# Altium project STM32_HM10_DC.PrjPcb
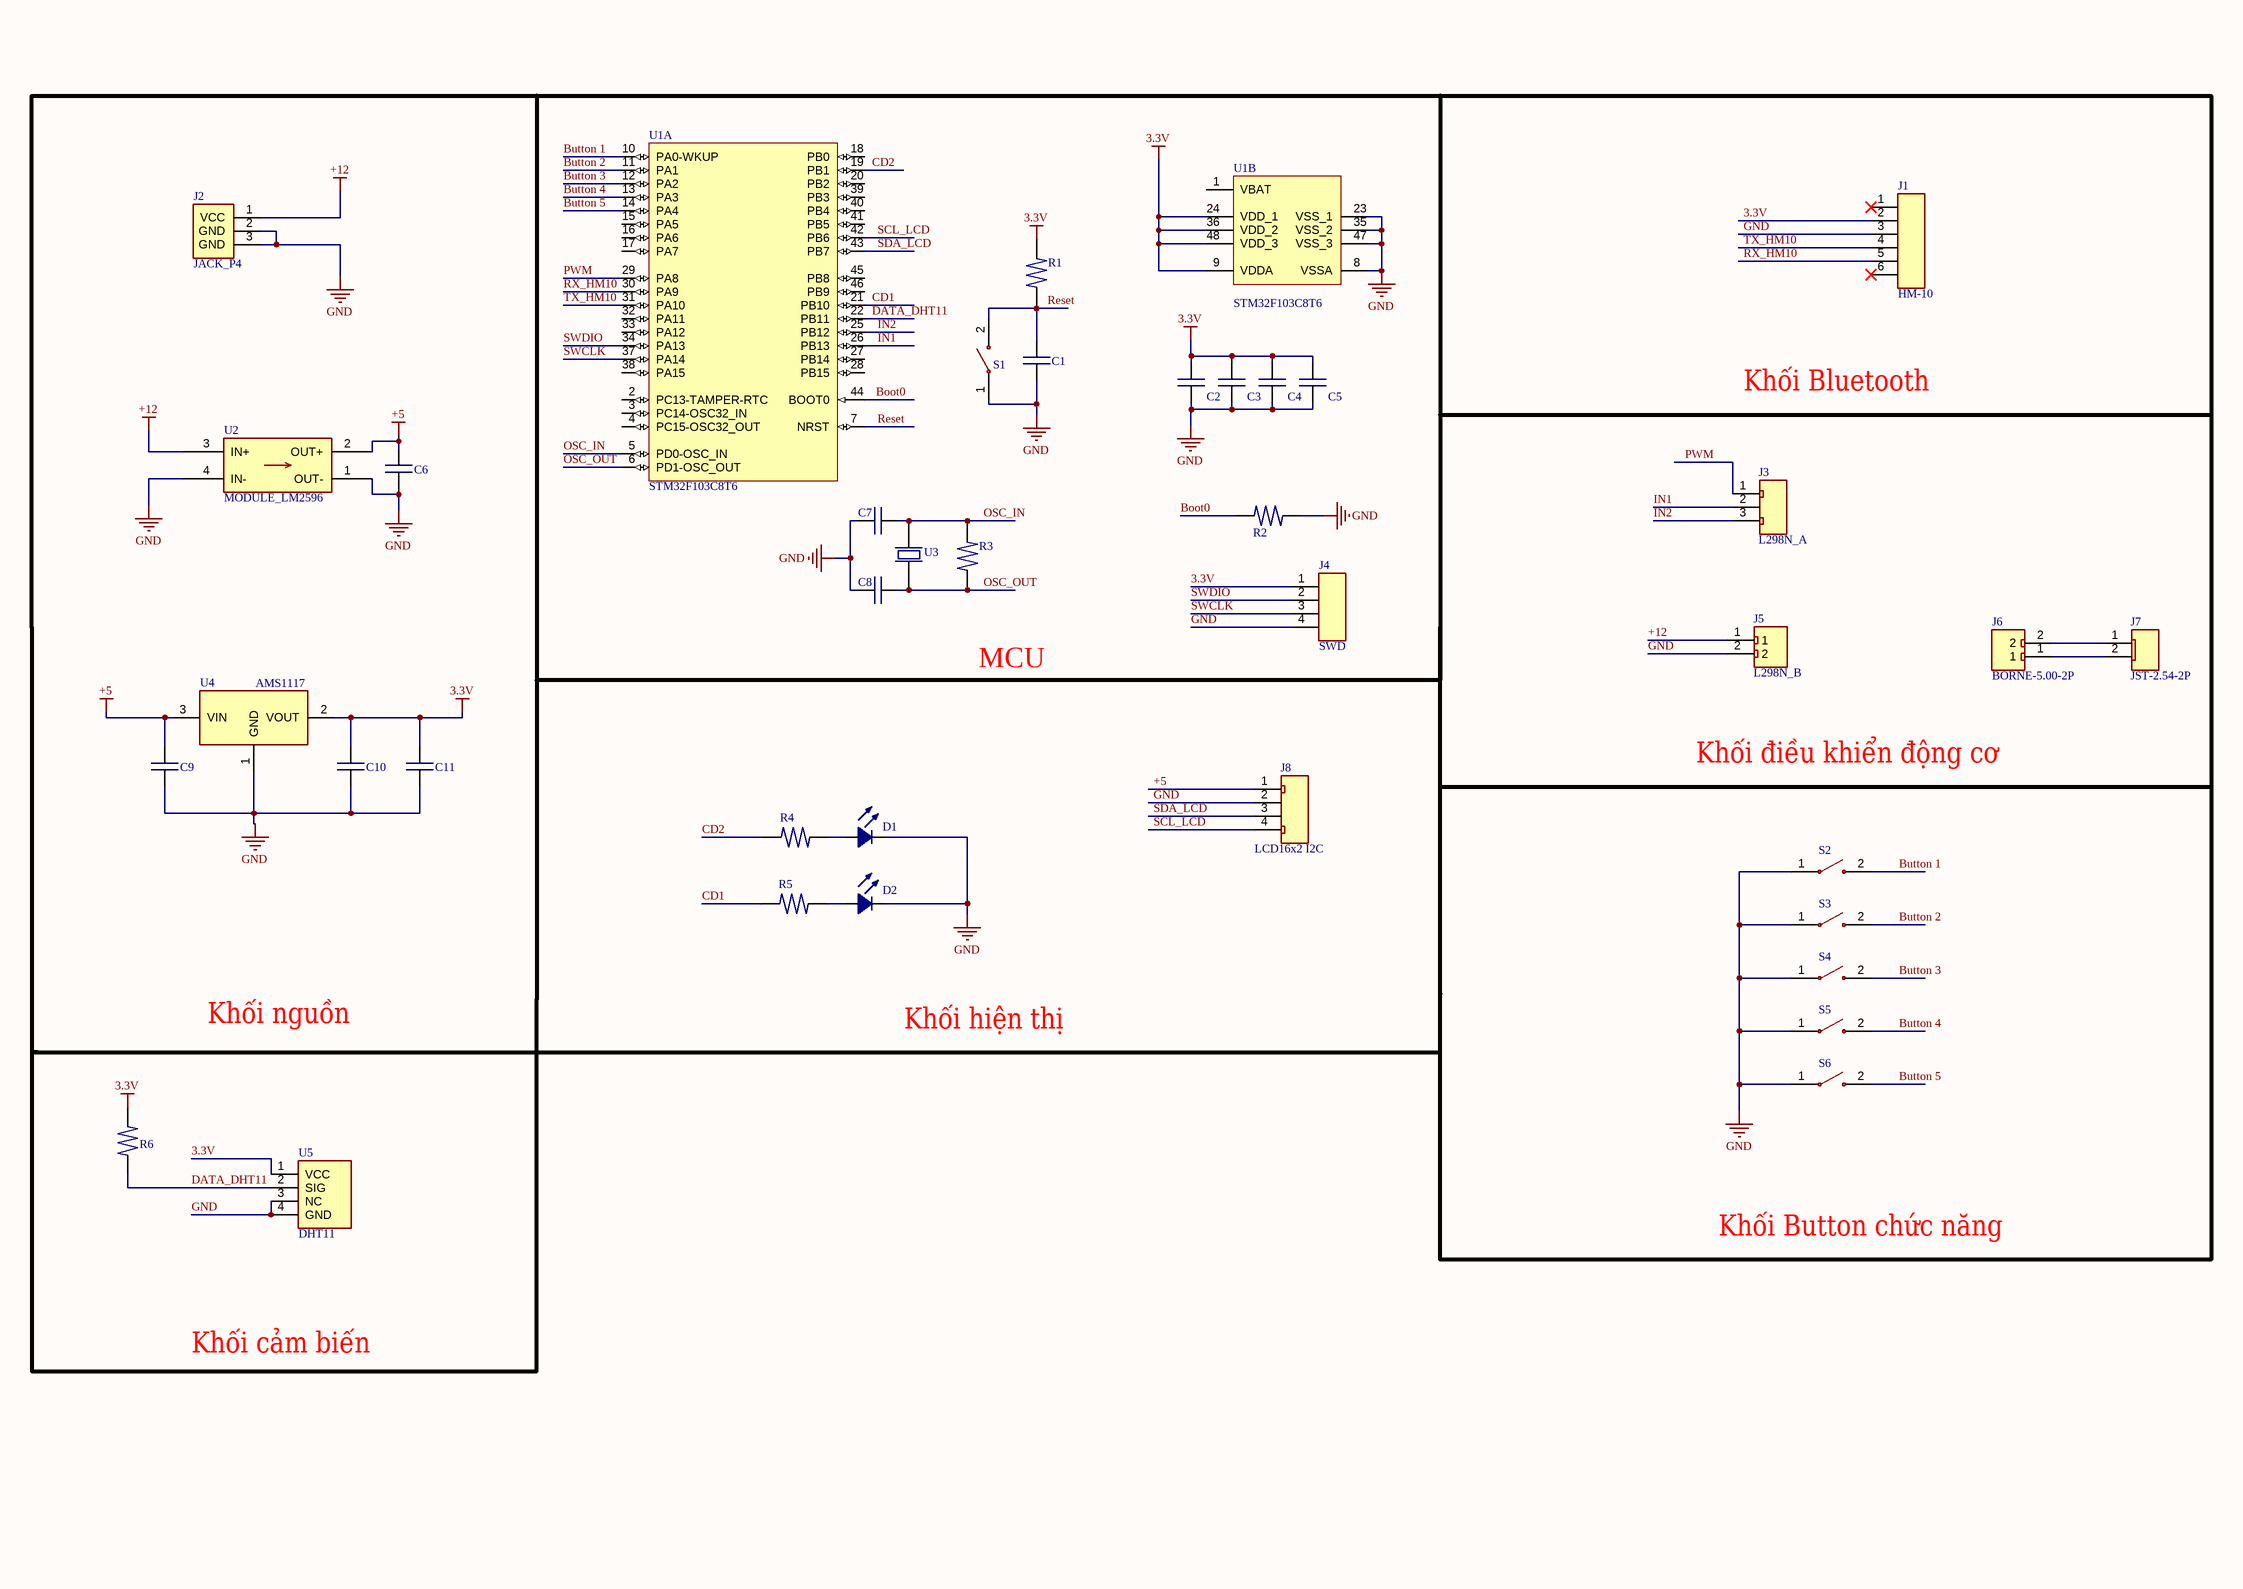
[diagram p0: Nguyen_Ly.SchDoc]
1 sheet, 38 parts. Net scope: global (net labels, ports and power ports of the same name join across sheets).
Board file: Mach_in.PcbDoc

## Sheet Nguyen_Ly.SchDoc
size 420 x 297 mm; SheetNumber: 1; SheetTotal: 1

### Parts
C1  CAPCITOR 104  [CAPACITOR 104]  (value not drawn)
C2  CAPACITOR 0603  [CAPACITOR 0603]  (value not drawn)
C3  CAPACITOR 0603  [CAPACITOR 0603]  (value not drawn)
C4  CAPACITOR 0603  [CAPACITOR 0603]  (value not drawn)
C5  CAPACITOR 0603  [CAPACITOR 0603]  (value not drawn)
C6  CAPCITOR 104  [CAPACITOR 104]  (value not drawn)
C7  CAPACITOR 0603  [CAPACITOR 0603]  (value not drawn)
C8  CAPACITOR 0603  [CAPACITOR 0603]  (value not drawn)
C9  CAPACITOR 0603  [CAPACITOR 0603]  (value not drawn)
C10  CAPACITOR 0603  [CAPACITOR 0603]  (value not drawn)
C11  CAPACITOR 0603  [CAPACITOR 0603]  (value not drawn)
D1  LED_5mm_YELLOW  [LED_5mm_YELLOW]  (value not drawn)
D2  LED_5mm_RED  [LED_5mm_RED]  (value not drawn)
J1  HM-10  [FEMALE-2.54-6P]
J2  JACK_P4  [JACK_P4]
J3  L298N_A  [JST-2.54-3P]
J4  SWD  [MALE-2.54-4P]
J5  L298N_B  [BORNE-5.00-2P]
J6  BORNE-5.00-2P  [BORNE-5.00-2P]
J7  JST-2.54-2P  [JST-2.54-2P]
J8  LCD16x2 I2C  [JST-2.54-4P]
R1  RESISTOR_9.5mm  [RESISTOR_PTH_9.5mm]  (value not drawn)
R2  RESISTOR_0603  [RESISTOR_0603]  (value not drawn)
R3  RESISTOR_0603  [RESISTOR_0603]  (value not drawn)
R4  RESISTOR_9.5mm  [RESISTOR_PTH_9.5mm]  (value not drawn)
R5  RESISTOR_9.5mm  [RESISTOR_PTH_9.5mm]  (value not drawn)
R6  RESISTOR_9.5mm  [RESISTOR_PTH_9.5mm]  (value not drawn)
S1  PUSH_BUTTON_6X6  [PUSH_BUTTON_6X6]  (value not drawn)
S2  PUSH_BUTTON_6X6  [PUSH_BUTTON_6X6]  (value not drawn)
S3  PUSH_BUTTON_6X6  [PUSH_BUTTON_6X6]  (value not drawn)
S4  PUSH_BUTTON_6X6  [PUSH_BUTTON_6X6]  (value not drawn)
S5  PUSH_BUTTON_6X6  [PUSH_BUTTON_6X6]  (value not drawn)
S6  PUSH_BUTTON_6X6  [PUSH_BUTTON_6X6]  (value not drawn)
U1  STM32F103C8T6  [STM-LQFP48_N]  (parts A,B of 2)
U2  MODULE_LM2596  [MODULE_LM2596]
U3  CRISTAL_16Mhz  [CRISTAL_16Mhz_SMD]  (value not drawn)
U4  AMS1117  [AMS1117]
U5  DHT11  [DHT11]

### Nets
3.3V: C2.2 C3.2 C4.2 C5.2 C10.2 C11.2 J1.2 J4.1 R1.2 R6.2 U1.9(VDDA) U1.24(VDD_1) U1.36(VDD_2) U1.48(VDD_3) U4.2(VOUT) U5.1(VCC)
+5: C6.2 C9.2 J8.1 U2.2(OUT+) U4.3(VIN)
+12: J2.1(VCC) J5.1 U2.3(IN+)
GND: C1.1 C2.1 C3.1 C4.1 C5.1 C6.1 C7.1 C8.1 C9.1 C10.1 C11.1 D1.2 D2.2 J1.3 J2.2(GND) J2.3(GND) J4.4 J5.2 J8.2 R2.1 S1.1 S2.1 S3.1 S4.1 S5.1 S6.1 U1.8(VSSA) U1.23(VSS_1) U1.35(VSS_2) U1.47(VSS_3) U2.1(OUT-) U2.4(IN-) U4.1(GND) U5.3(NC) U5.4(GND)
Boot0: R2.2 U1.44(BOOT0)
Button 1: S2.2 U1.10(PA0-WKUP)
Button 2: S3.2 U1.11(PA1)
Button 3: S4.2 U1.12(PA2)
Button 4: S5.2 U1.13(PA3)
Button 5: S6.2 U1.14(PA4)
CD1: R5.1 U1.21(PB10)
CD2: R4.1 U1.19(PB1)
DATA_DHT11: R6.1 U1.22(PB11) U5.2(SIG)
IN1: J3.2 U1.26(PB13)
IN2: J3.3 U1.25(PB12)
OSC_IN: C7.2 R3.2 U1.5(PD0-OSC_IN) U3.2
OSC_OUT: C8.2 R3.1 U1.6(PD1-OSC_OUT) U3.1
PWM: J3.1 U1.29(PA8)
Reset: C1.2 R1.1 S1.2 U1.7(NRST)
RX_HM10: J1.5 U1.30(PA9)
SCL_LCD: J8.4 U1.42(PB6)
SDA_LCD: J8.3 U1.43(PB7)
SWCLK: J4.3 U1.37(PA14)
SWDIO: J4.2 U1.34(PA13)
TX_HM10: J1.4 U1.31(PA10)
NetD1_1: D1.1 R4.2
NetD2_1: D2.1 R5.2
NetJ6_1: J6.1 J7.2
NetJ6_2: J6.2 J7.1

Not connected (* = marked no-connect by the designer): J1 1* 6*; U1 1(VBAT) 2(PC13-TAMPER-RTC) 3(PC14-OSC32_IN) 4(PC15-OSC32_OUT) 15(PA5) 16(PA6) 17(PA7) 18(PB0) 20(PB2) 27(PB14) 28(PB15) 32(PA11) 33(PA12) 38(PA15) 39(PB3) 40(PB4) 41(PB5) 45(PB8) 46(PB9)

### Notes on the sheet
- Khối Bluetooth
- MCU
- Khối điều khiển động cơ
- Khối nguồn
- Khối hiện thị
- Khối Button chức năng
- Khối cảm biến
- THIS DOCUMENT AND THE DATA DISCLOSED HEREIN OR
- HEREWITH IS THE PROPERTY OF ALTIUM LIMITED AND MAY
- DWG NO:
- REVISION
- REV:
- DESCRIPTION
- DATE
- APPROVED
- BE FREELY DISTRIBUTED IN WHOLE. NO RIGHTS ARE
- RESERVED OR EXPRESS OR IMPLIED WARANTEE GIVEN.
- ENG:
- APPROVALS
- PROJECT
- DSN:
- CHK:
- REFERENCE DOCUMENTS
- PROJECT REVISION:
- TITLE
- DOCUMENT REVISION:
- DESIGN ITEM:
- BOM:
- FAB DWG:
- PCB DWG:
- ASSY DWG:
- SCALE:
- A3
- SIZE
- CAGE CODE
- FILE NAME
- DWG NO.
- SHEET
- OF
- REV

### Library data of the parts
C1 C6 = CAPACITOR 104: Ceramic Capacitor 104, 3mm.
C2-C5 C7-C11 = CAPACITOR 0603: Generic Capacitor 0603, 1.6x0.8x0.9mm.
D1 = LED_5mm_YELLOW: LED PTH 5mm Yellow.
D2 = LED_5mm_RED: LED PTH 5mm Red.
J1 = FEMALE-2.54-6P: Female Header Connector 2.54mm 6 Pins.; JLCPCB PN: C5224026
J2 = JACK_P4: 9V Battery Connector Jack P4.
J3 = JST-2.54-3P: Female Connector JST 3 Vias, 2.54mm.
J4 = MALE-2.54-4P: Male Header Connector 2.54mm 4 Pins.; JLCPCB PN: C492403
J5 J6 = BORNE-5.00-2P: Borne 2 Vias, Pitch 5mm.; JLCPCB PN: C91153
J7 = JST-2.54-2P: Female Connector JST 2 Vias, 2.54mm.
J8 = JST-2.54-4P: Female Connector JST 4 Vias, 2.54mm.
R1 R4-R6 = RESISTOR_9.5mm: Generic Resistor 9.5mm.
R2 R3 = RESISTOR_0603: Generic Resistor 0603.
S1-S6 = PUSH_BUTTON_6X6: Push Button Tactile Switch PTH 4 Pins 6x6mm.; JLCPCB PN: C255811
U1 = STM32F103C8T6: ARM Cortex-M3 32-bit MCU, 64 KB Flash, 20 KB Internal RAM, 37 I/Os, 48-pin LQFP, -40 to 85 degC, Tray; A/D Converter: 2x12-bit (10 Channel); FLASH Size (Prog) (kB): 64; I/Os (High Current): 37; Internal RAM Size (kB): 20; Operating Frequency(F) (Processor speed) (MHz): 72; Supply Voltage(Vcc) min (V): 2; DatasheetVersion: Rev. 16; PackageVersion: Rev. 6, 06/2013; PackageReference: LQFP48; PackageDescription: 48-Pin Low Profile Quad Flat Package, 7 x 7 mm Body, 0.5 mm Pitch; Supplier 1: Digi-Key; Supplier Part Number 1: 497-6063-ND; Supplier 2: Farnell; Supplier Part Number 2: 1447637; Supplier 3: Newark; Supplier Part Number 3: 59M2182; Supplier 4: Newark; Supplier Part Number 4: 57P1222; Supplier 5: Mouser; Supplier Part Number 5: 511-STM32F103C8T6; Core: ARM Cortex-M3; Packing: Tray; Mounting Technology: Surface Mount; PartNumber: STM32F103C8T6; ComponentLink1Description: Manufacturer URL; ComponentLink1URL: http://www.st.com/web/en/home.html; ComponentLink2Description: Datasheet; ComponentLink2URL: http://www.st.com/st-web-ui/static/active/en/resource/technical/document/datasheet/CD00161566.pdf; ComponentLink3Description: Package Specification; ComponentLink3URL: http://www.st.com/st-web-ui/static/active/en/resource/technical/document/datasheet/DM00058181.pdf
U2 = MODULE_LM2596: MODULE BUCK STEP DOWN 3A 43x20mm; ComponentLink1Description: Datasheet; ComponentLink1URL: https://www.ti.com/lit/ds/symlink/lm2596.pdf
U3 = CRISTAL_16Mhz: CRYSTAL 16MHZ, PTH and SMD; Mouser PN: 449-LFXTAL022786BULK; Digikey PN: 3155-16M20P2/49US-ND
U4 = AMS1117: IC REG LINEAR 1A SOT-89-3L; ComponentLink1Description: Datasheet; ComponentLink1URL: http://www.advanced-monolithic.com/pdf/ds1117.pdf; Digikey PN: 4518-AMS1117-3.3CT-ND; JLCPCB PN: C963410
U5 = DHT11: SENSOR HUMIDITY/TEMPERATURE; Digikey PN: 1528-1228-ND